# Altium project golgi_bot_H_bridge.PrjPcb
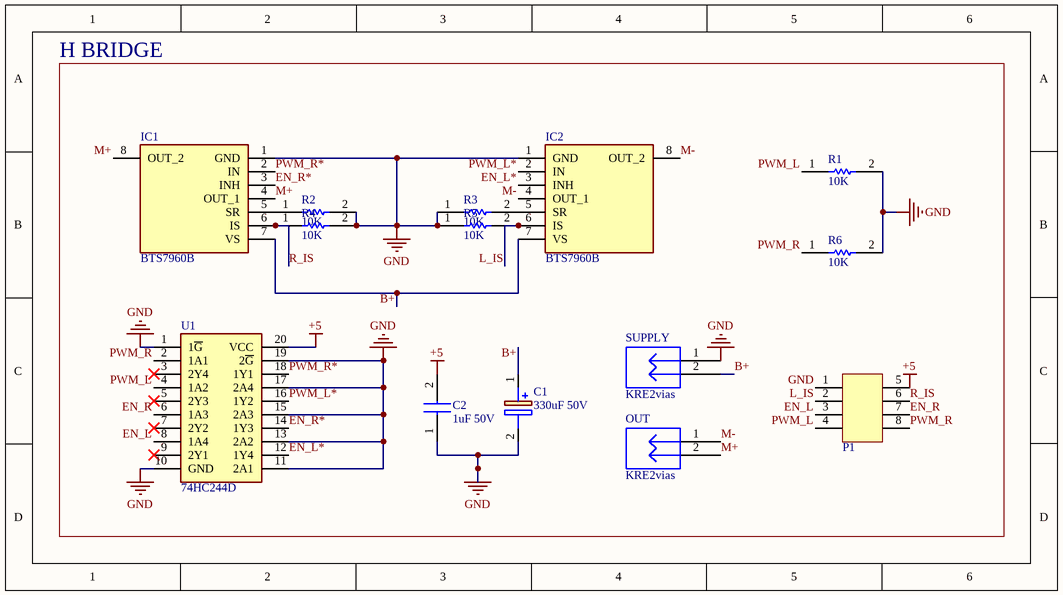
[diagram p0: golgi_bot_H_bridge.SchDoc]
1 sheet, 14 parts. Net scope: global (net labels, ports and power ports of the same name join across sheets).
Board file: golgi_bot_H_bridge.PcbDoc

## Sheet golgi_bot_H_bridge.SchDoc
size 198 x 110 mm; SheetNumber: 1; SheetTotal: 1

### Parts
C1  330uF 50V  [CAPPRD750W85D1600H1650]
C2  1uF 50V  [CAPC3216X180N]
IC1  BTS7960B  [BTS7960B]
IC2  BTS7960B  [BTS7960B]
OUT  KRE2vias  [KRE2-2vias]
P1  PIN BAR 2X4  [MALE PIN BAR 2X4]  (value not drawn)
R1  10K  [RESC3216X60N]
R2  10K  [RESC3216X60N]
R3  10K  [RESC3216X60N]
R4  10K  [RESC3216X60N]
R5  10K  [RESC3216X60N]
R6  10K  [RESC3216X60N]
SUPPLY  KRE2vias  [KRE2-2vias]
U1  74HC244D  [SOIC127P1030X250-20N]

### Blocks framed on the sheet
H BRIDGE: C1 C2 IC1 IC2 OUT P1 R1-R6 SUPPLY U1

### Nets
+5: C2.2 P1.5 U1.20(VCC)
GND: C1.2(-) C2.1 IC1.1(GND) IC2.1(GND) P1.1 R1.2 R2.2 R3.1 R4.2 R5.1 R6.2 SUPPLY.1 U1.1(1~{G}) U1.10(GND) U1.11(2A1) U1.13(2A2) U1.15(2A3) U1.17(2A4) U1.19(2~{G})
B+: C1.1(+) IC1.7(VS) IC2.7(VS) SUPPLY.2
EN_L: P1.3 U1.8(1A4)
EN_L*: IC2.3(INH) U1.12(1Y4)
EN_R: P1.7 U1.6(1A3)
EN_R*: IC1.3(INH) U1.14(1Y3)
L_IS: IC2.6(IS) P1.2 R5.2
M+: IC1.4(OUT_1) IC1.8(OUT_2) OUT.2
M-: IC2.4(OUT_1) IC2.8(OUT_2) OUT.1
PWM_L: P1.4 R1.1 U1.4(1A2)
PWM_L*: IC2.2(IN) U1.16(1Y2)
PWM_R: P1.8 R6.1 U1.2(1A1)
PWM_R*: IC1.2(IN) U1.18(1Y1)
R_IS: IC1.6(IS) P1.6 R4.1
NetIC1_5: IC1.5(SR) R2.1
NetIC2_5: IC2.5(SR) R3.2

Not connected (* = marked no-connect by the designer): U1 3(2Y4)* 5(2Y3)* 7(2Y2)* 9(2Y1)*

### Library data of the parts
C1 = Capacitor eletrolítico: capacitor 330uf 50V; Manufacturer_Name: Panasonic; Manufacturer_Part_Number: EEU-TA1H331S; Datasheet Link: http://industrial.panasonic.com/cdbs/www-data/pdf/RDF0000/ABA0000C1212.pdf; Height: 16.5mm
C2 = Capacitor Cerâmico 1206: Capacitor; Manufacturer_Name: TDK; Manufacturer_Part_Number: C3216X5R0J226M160AA; Datasheet Link: https://product.tdk.com/info/en/catalog/datasheets/mlcc_commercial_midvoltage_en.pdf; Height: 1.8mm; Mouser Part Number: 810-C3216X5R0J226M-6; Mouser Price/Stock: https://www.mouser.com/Search/Refine.aspx?Keyword=810-C3216X5R0J226M-6
IC1 IC2 = BTS7960B: Integrated Circuit; Manufacturer_Name: Rochester Electronics; Height: 4.4mm; Manufacturer_Part_Number: BTS7960B
OUT SUPPLY = KRE2vias: Conector 2 vias; Descrição: Conector KRE 2 vias 180º; Encapsulamento: PTH - 180º; Modelo: 2 vias - 180º; Marca: *; Observação: *
P1 = Male pin bar 2x4: Manufacturer: Cromax; Mounting Angle: Vertical; Number of Positions: 40 Position; Pitch: 2 mm; Supplier 1: -; Manufacturer Part Number: -; RoHS: RoHS Compliant; Category: Headers & Wire Housings; Stock 1: 14; Pricing 1: 1=1.60, 2=0.80 (BRL); Accessory Type: -; Contact Plating: Gold; Contact Type: -; Number of Rows: 1 Row; Product: Headers; Termination Style: Through Hole; Type: Breakaway; Brand: Cromax; Mounting Style: Straight Pin; Row Spacing: -; Contact Gender: Pin (Female); Product Category: Accessories; RoHS - Mouser: Y; Minimum Order Quantity: 1; Reeling: False; ComponentLink1URL: -; ComponentLink1Description: -; Supplier Part Number 1: -
R1-R6 = Resistor 1206: Manufacturer_Name: Vishay; Manufacturer_Part_Number: CRCW12064K70FKEA; Datasheet Link: http://docs-emea.rs-online.com/webdocs/13ec/0900766b813ecc08.pdf; Height: 0.6mm; Mouser Part Number: 71-CRCW1206-4.7K-E3; Mouser Price/Stock: https://www.mouser.co.uk/ProductDetail/Vishay-Dale/CRCW12064K70FKEA?qs=1vm4qhDHCvlKJmatsKzyFQ%3D%3D; Arrow Part Number: CRCW12064K70FKEA; Arrow Price/Stock: https://www.arrow.com/en/products/crcw12064k70fkea/vishay
U1 = 74HC244D: Integrated Circuit; Manufacturer_Name: Toshiba; Datasheet Link: https://www.arrow.com/en/products/74hc244d/toshiba; Height: 2.5mm; Manufacturer_Part_Number: 74HC244D; Mouser Part Number: 757-74HC244D; Mouser Price/Stock: https://www.mouser.co.uk/ProductDetail/Toshiba/74HC244D?qs=7EBvPakHacWwVm6mPM9mPg%3D%3D; Arrow Part Number: 74HC244D; Arrow Price/Stock: https://www.arrow.com/en/products/74hc244d/toshiba?region=nac